# EAGLE design LedDriverBreakout (EAGLE 7.2.0)
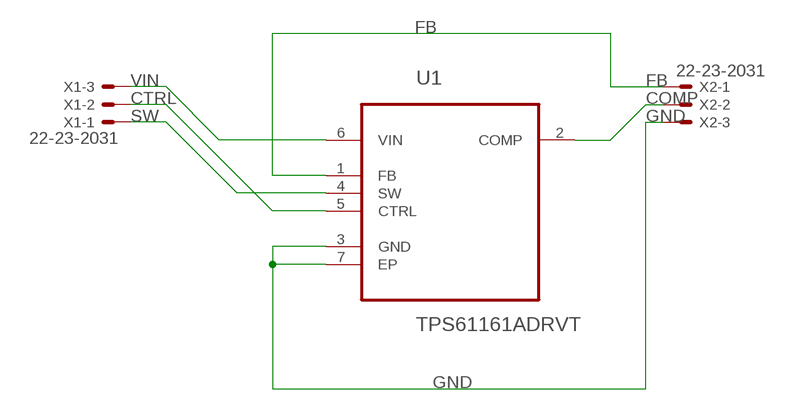
[diagram p0: schematic, sheet 1]

## Parts
U1  TPS61161ADRVT  [SON65P200X200X80-7N]
X1  22-23-2031  [22-23-2031]
X2  22-23-2031  [22-23-2031]

## Nets
COMP: U1.2(COMP) X2.2
CTRL: U1.5(CTRL) X1.2
FB: U1.1(FB) X2.1
GND: U1.3(GND) U1.7(EP) X2.3
SW: U1.4(SW) X1.1
VIN: U1.6(VIN) X1.3

## Library data of the parts
U1 = Texas Instruments_By_element14_Batch_1:TPS61161ADRVT: White LED Driver With PWM; MPN: TPS61161ADRVT; OC_FARNELL: 1735594; OC_NEWARK: 10R0471; PACKAGE: SON-6; SUPPLIER: Texas Instruments
X1 X2 = con-molex:22-23-2031: .100" (2.54mm) Center Header - 3 Pin; MF: MOLEX; MPN: 22-23-2031; OC_FARNELL: 1462950; OC_NEWARK: 30C0862

## Board
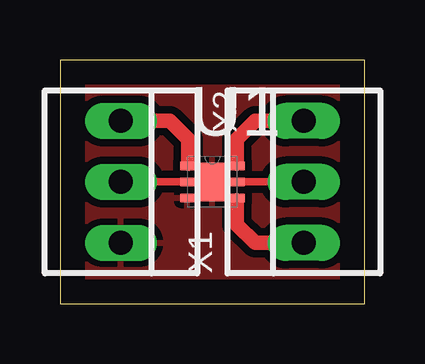
[diagram p1: board, top side]

Size 12.7 x 10.16 mm. Coordinates in mm from the lower left corner, seen from the top.
Outline: 0,0 12.7,0 12.7,10.16 0,10.16 0,0
Copper layers (1*16): Top 0.035mm / dielectric 1.5mm / Bottom 0.035mm
Design rules "default": minimum track width 10mil, minimum drill 24mil, track to track 8mil, track to pad 8mil, pad to pad 8mil, via to via 8mil, smd to smd 8mil, copper to edge 40mil, drill to drill 8mil, minimum pad ring 10mil, minimum via ring 8mil, stop-mask expansion 4mil, vias tented up to drill 0mil, thermal gap 10mil

### Footprints (pad centres in the part's own frame; a part is rotated, then mirrored left to right if it is on the bottom)
SON65P200X200X80-7N = smd 0.61 x 0.356: 1 -1.041,0.66; 2 -1.041,0; 3 -1.041,-0.66; 4 1.041,-0.66; 5 1.041,0; 6 1.041,0.66 | smd 0.991 x 1.6: 7 0,0
22-23-2031 = drill 1 long: 1 -2.54,0; 2 0,0; 3 2.54,0

### Placement (x,y rotation side)
U1  6.35,5.08 0 top
X1  10.16,5.08 90 top
X2  2.54,5.08 270 top

### Tracks (layer width: path | path; a pad name or v marks a point on that pad's centre or on a via)
COMP
  Top 0.305: U1.2 X2.2
CTRL
  Top 0.305: U1.5 X1.2
FB
  Top 0.305: U1.1 5.31,5.82 5.33,5.84
  Top 0.61: 5.33,5.84 5.33,6.86 4.57,7.62 X2.1
GND
  pour Top (isolate 0.305): 0,0 0,10.16 12.7,10.16 12.7,0
SW
  Top 0.305: U1.4 7.39,4.34 7.37,4.32
  Top 0.61: 7.37,4.32 7.37,3.3 8.13,2.54 X1.1
VIN
  Top 0.305: U1.6 7.39,5.82 7.37,5.84
  Top 0.61: 7.37,5.84 7.37,6.86 8.13,7.62 X1.3